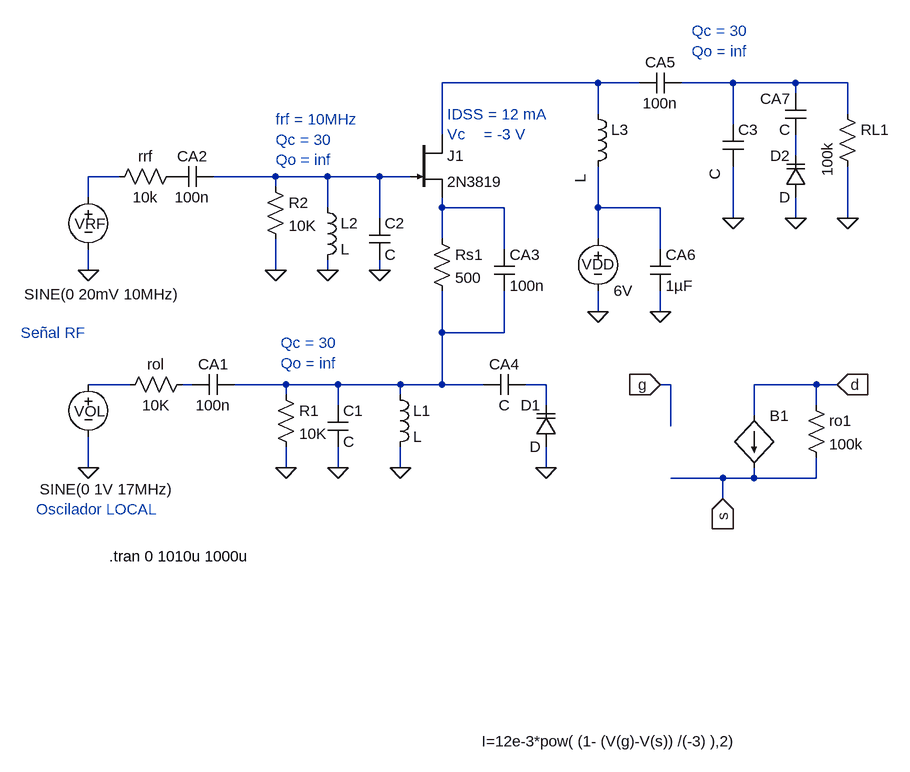
[diagram p0: schematic mixer.asc]
mixer.asc, the LTspice schematic file:
Version 4
SHEET 1 1332 900
WIRE 688 -144 448 -144
WIRE 752 -144 688 -144
WIRE 896 -144 816 -144
WIRE 992 -144 896 -144
WIRE 1072 -144 992 -144
WIRE 992 -128 992 -144
WIRE 688 -96 688 -144
WIRE 1072 -96 1072 -144
WIRE 896 -80 896 -144
WIRE 448 -64 448 -144
WIRE 992 -32 992 -64
WIRE -48 0 -96 0
WIRE 192 0 96 0
WIRE 272 0 192 0
WIRE 352 0 272 0
WIRE 400 0 352 0
WIRE 192 16 192 0
WIRE -96 32 -96 0
WIRE 272 48 272 0
WIRE 448 48 448 32
WIRE 544 48 448 48
WIRE 688 48 688 -16
WIRE 784 48 688 48
WIRE 352 64 352 0
WIRE 896 64 896 -16
WIRE 992 64 992 32
WIRE 1072 64 1072 -16
WIRE 448 96 448 48
WIRE 688 96 688 48
WIRE 544 112 544 48
WIRE 784 112 784 48
WIRE -96 144 -96 112
WIRE 192 144 192 96
WIRE 272 144 272 128
WIRE 352 144 352 128
WIRE 688 208 688 176
WIRE 784 208 784 176
WIRE 448 240 448 176
WIRE 544 240 544 176
WIRE 544 240 448 240
WIRE -32 320 -96 320
WIRE 64 320 48 320
WIRE 208 320 128 320
WIRE 288 320 208 320
WIRE 384 320 288 320
WIRE 448 320 448 240
WIRE 448 320 384 320
WIRE 512 320 448 320
WIRE 608 320 576 320
WIRE 800 320 784 320
WIRE 1024 320 928 320
WIRE 1056 320 1024 320
WIRE 208 336 208 320
WIRE 384 336 384 320
WIRE 288 352 288 320
WIRE 608 352 608 320
WIRE 1024 352 1024 320
WIRE 928 368 928 320
WIRE 800 384 800 320
WIRE -96 448 -96 400
WIRE 208 448 208 416
WIRE 288 448 288 416
WIRE 384 448 384 416
WIRE 608 448 608 416
WIRE 880 464 800 464
WIRE 928 464 928 448
WIRE 928 464 880 464
WIRE 1024 464 1024 432
WIRE 1024 464 928 464
WIRE 880 496 880 464
FLAG 384 448 0
FLAG -96 144 0
FLAG 784 320 g
IOPIN 784 320 In
FLAG 688 208 0
FLAG 1056 320 d
IOPIN 1056 320 In
FLAG -96 448 0
FLAG 880 496 s
IOPIN 880 496 In
FLAG 272 144 0
FLAG 352 144 0
FLAG 208 448 0
FLAG 288 448 0
FLAG 608 448 0
FLAG 192 144 0
FLAG 896 64 0
FLAG 1072 64 0
FLAG 784 208 0
FLAG 992 64 0
SYMBOL res 48 -16 R90
WINDOW 0 0 56 VBottom 2
WINDOW 3 32 56 VTop 2
SYMATTR InstName rrf
SYMATTR Value 10k
SYMBOL cap 96 -16 R90
WINDOW 0 0 32 VBottom 2
WINDOW 3 32 32 VTop 2
SYMATTR InstName CA2
SYMATTR Value 100n
SYMBOL bi 928 368 R0
WINDOW 3 -419 501 Left 2
SYMATTR Value I=12e-3*pow( (1- (V(g)-V(s)) /(-3) ),2)
SYMATTR InstName B1
SYMBOL ind 672 -112 R0
WINDOW 3 -11 122 VLeft 2
SYMATTR InstName L3
SYMBOL res 1008 336 R0
SYMATTR InstName ro1
SYMATTR Value 100k
SYMBOL cap 880 -80 R0
WINDOW 3 -12 85 VLeft 2
SYMATTR InstName C3
SYMBOL res 1056 -112 R0
WINDOW 3 -15 112 VLeft 2
SYMATTR Value 100k
SYMATTR InstName RL1
SYMBOL voltage -96 16 R0
WINDOW 123 -107 192 Left 2
WINDOW 39 0 0 Left 0
WINDOW 0 -21 57 Left 2
WINDOW 3 -99 165 Left 2
SYMATTR InstName VRF
SYMATTR Value SINE(0 20mV 10MHz)
SYMBOL res 432 80 R0
SYMATTR InstName Rs1
SYMATTR Value 500
SYMBOL cap 528 112 R0
SYMATTR InstName CA3
SYMATTR Value 100n
SYMBOL voltage 688 80 R0
WINDOW 123 0 0 Left 0
WINDOW 39 0 0 Left 0
WINDOW 0 -25 55 Left 2
SYMATTR InstName VDD
SYMATTR Value 6V
SYMBOL cap 128 304 R90
WINDOW 0 0 32 VBottom 2
WINDOW 3 32 32 VTop 2
SYMATTR InstName CA1
SYMATTR Value 100n
SYMBOL voltage -96 304 R0
WINDOW 123 0 0 Left 0
WINDOW 39 0 0 Left 0
WINDOW 0 -22 57 Left 2
WINDOW 3 -75 177 Left 2
SYMATTR InstName VOL
SYMATTR Value SINE(0 1V 17MHz)
SYMBOL res 64 304 R90
WINDOW 0 0 56 VBottom 2
WINDOW 3 32 56 VTop 2
SYMATTR InstName rol
SYMATTR Value 10K
SYMBOL njf 400 -64 R0
SYMATTR InstName J1
SYMATTR Value 2N3819
SYMBOL ind 256 32 R0
SYMATTR InstName L2
SYMBOL cap 336 64 R0
SYMATTR InstName C2
SYMBOL ind 368 320 R0
SYMATTR InstName L1
SYMBOL cap 272 352 R0
SYMATTR InstName C1
SYMBOL res 192 320 R0
SYMATTR InstName R1
SYMATTR Value 10K
SYMBOL varactor 624 416 R180
WINDOW 0 24 64 Left 2
WINDOW 3 24 0 Left 2
SYMATTR InstName D1
SYMBOL cap 576 304 R90
WINDOW 0 0 32 VBottom 2
WINDOW 3 32 32 VTop 2
SYMATTR InstName CA4
SYMBOL res 176 0 R0
SYMATTR InstName R2
SYMATTR Value 10K
SYMBOL cap 816 -160 R90
WINDOW 0 0 32 VBottom 2
WINDOW 3 32 32 VTop 2
SYMATTR InstName CA5
SYMATTR Value 100n
SYMBOL cap 768 112 R0
SYMATTR InstName CA6
SYMATTR Value 1µF
SYMBOL varactor 1008 32 R180
WINDOW 0 24 64 Left 2
WINDOW 3 24 0 Left 2
SYMATTR InstName D2
SYMBOL cap 1008 -64 R180
WINDOW 0 24 56 Left 2
WINDOW 3 24 8 Left 2
SYMATTR InstName CA7
TEXT -64 584 Left 2 !.tran 0 1010u 1000u
TEXT -176 512 Left 2 ;Oscilador LOCAL
TEXT -200 240 Left 2 ;Señal RF
TEXT 456 -96 Left 2 ;IDSS = 12 mA\nVc    = -3 V
TEXT 192 -88 Left 2 ;frf = 10MHz\nQc = 30\nQo = inf
TEXT 200 256 Left 2 ;Qc = 30\nQo = inf
TEXT 832 -224 Left 2 ;Qc = 30\nQo = inf

The netlist it stands for:
* mixer.asc
rrf P001 N004 10k
CA2 N005 P001 100n
B1 d s I=12e-3*pow( (1- (V(g)-V(s)) /(-3) ),2)
L3 N001 N007 L
ro1 d s 100k
C3 N002 0 C
RL1 N002 0 100k
VRF N004 0 SINE(0 20mV 10MHz)
Rs1 N006 N008 500
CA3 N006 N008 100n
VDD N007 0 6V
CA1 N008 N010 100n
VOL N009 0 SINE(0 1V 17MHz)
rol N010 N009 10K
J1 N001 N005 N006 2N3819
L2 N005 0 L
C2 N005 0 C
L1 N008 0 L
C1 N008 0 C
R1 N008 0 10K
D1 0 N011 D
CA4 N011 N008 C
R2 N005 0 10K
CA5 N002 N001 100n
CA6 N007 0 1µF
D2 0 N003 D
CA7 N003 N002 C
.model D D
.lib standard.dio
.model NJF NJF
.model PJF PJF
.lib standard.jft
.tran 0 1010u 1000u
* Oscilador LOCAL
* Señal RF
* IDSS = 12 mA
* Vc    = -3 V
* frf = 10MHz
* Qc = 30
* Qo = inf
* Qc = 30
* Qo = inf
* Qc = 30
* Qo = inf
.backanno
.end